# EAGLE schematic Memory_Flash_MicroSD_Amphenol_101-00660-68-6 (EAGLE 6.5.0)
Micro SD Card Socket Amphenol 101-00660-68-6 <http://media.digikey.com/pdf/Data%20Sheets/Amphenol%20PDFs/101-00660.pdf> Card detect pin, CD_DCT: low = card in
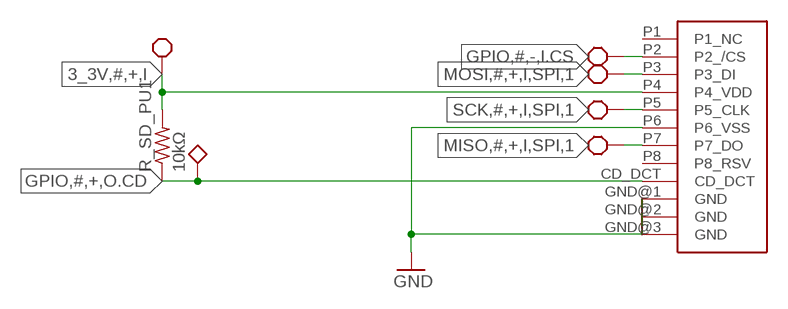
[diagram p0: schematic, sheet 1]

## Parts
R_SD_PU1  10kΩ  R-US_R0603  [R0603]
SD_SOCKET1  2908-05WB-MG  [2908-05WB-MG]

## Nets
3_3V,#,+,I: R_SD_PU1.2 SD_SOCKET1.P4(P4_VDD) ; supply symbol labelled BLOCK_REQUIREMENT
GND: SD_SOCKET1.GND@1(GND) SD_SOCKET1.GND@2(GND) SD_SOCKET1.GND@3(GND) SD_SOCKET1.P6(P6_VSS)
GPIO,#,+,O.CD: R_SD_PU1.1 SD_SOCKET1.CD_DCT ; supply symbol labelled BLOCK_RECOMMENDED
GPIO,#,-,I.CS: SD_SOCKET1.P2(P2_/CS) ; supply symbol labelled BLOCK_REQUIREMENT
MISO,#,+,I,SPI,1: SD_SOCKET1.P7(P7_DO) ; supply symbol labelled BLOCK_REQUIREMENT
MOSI,#,+,I,SPI,1: SD_SOCKET1.P3(P3_DI) ; supply symbol labelled BLOCK_REQUIREMENT
SCK,#,+,I,SPI,1: SD_SOCKET1.P5(P5_CLK) ; supply symbol labelled BLOCK_REQUIREMENT
Unconnected: SD_SOCKET1.P1(P1_NC) SD_SOCKET1.P8(P8_RSV)

## Library data of the parts
R_SD_PU1 = resistor:R-US_: RESISTOR, American symbol
SD_SOCKET1 = piccoli:2908-05WB-MG: CONN EJECT MICROSD PUSH-PUSH SMD 3M? Card Connector microSD?

## Net classes
4 xxwide: width 0.203 mm